# Altium schematic sheet Spring_counter_part.SchDoc: Spring Counter Part
size A3; Date: 26.05.2024; DrawnBy: Yan Gridling; Organization: HTW Chur; Address1: Pulvermühlestrasse 57; Address2: 7004 Chur; Address3: Switzerland; DocumentNumber: 1; Revision: V1.0; SheetNumber: 1; SheetTotal: 1; DocumentName: HTW Template
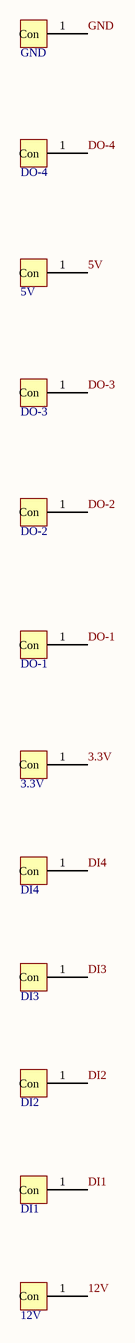
[diagram p0: Spring_counter_part.SchDoc]

## Parts
3.3V  Spring_Pad_331031321515  [Spring_Contact_Pad_331031321515]  (value not drawn)
5V  Spring_Pad_331031321515  [Spring_Contact_Pad_331031321515]  (value not drawn)
12V  Spring_Pad_331031321515  [Spring_Contact_Pad_331031321515]  (value not drawn)
DI1  Spring_Pad_331031321515  [Spring_Contact_Pad_331031321515]  (value not drawn)
DI2  Spring_Pad_331031321515  [Spring_Contact_Pad_331031321515]  (value not drawn)
DI3  Spring_Pad_331031321515  [Spring_Contact_Pad_331031321515]  (value not drawn)
DI4  Spring_Pad_331031321515  [Spring_Contact_Pad_331031321515]  (value not drawn)
DO-1  Spring_Pad_331031321515  [Spring_Contact_Pad_331031321515]  (value not drawn)
DO-2  Spring_Pad_331031321515  [Spring_Contact_Pad_331031321515]  (value not drawn)
DO-3  Spring_Pad_331031321515  [Spring_Contact_Pad_331031321515]  (value not drawn)
DO-4  Spring_Pad_331031321515  [Spring_Contact_Pad_331031321515]  (value not drawn)
GND  Spring_Pad_331031321515  [Spring_Contact_Pad_331031321515]  (value not drawn)

## Nets
3.3V: 3.3V.1(Con)
5V: 5V.1(Con)
12V: 12V.1(Con)
DI1: DI1.1(Con)
DI2: DI2.1(Con)
DI3: DI3.1(Con)
DI4: DI4.1(Con)
DO-1: DO-1.1(Con)
DO-2: DO-2.1(Con)
DO-3: DO-3.1(Con)
DO-4: DO-4.1(Con)
GND: GND.1(Con)

## Notes on the sheet
- Drawn by:
- Title:
- Date:
- Sheet
- of
- Size:
- Revision:
- A3
- File: